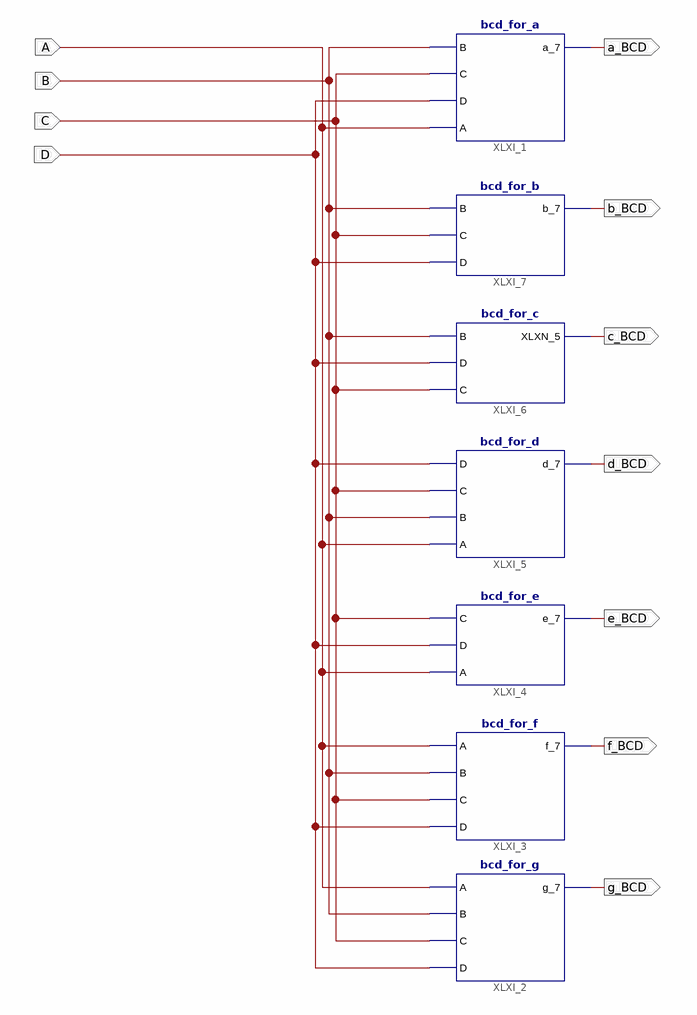
[diagram p0: schematic sheet 1]
// Xilinx ISE schematic BCD_Decoder.sch (spartan6) as structural Verilog: 7 symbols, 11 ports
module BCD_Decoder (
  input  A,
  input  B,
  input  C,
  input  D,
  output a_BCD,
  output b_BCD,
  output c_BCD,
  output d_BCD,
  output e_BCD,
  output f_BCD,
  output g_BCD
);

  bcd_for_a XLXI_1 (.B(B), .C(C), .D(D), .A(A), .a_7(a_BCD));
  bcd_for_g XLXI_2 (.A(A), .B(B), .C(C), .D(D), .g_7(g_BCD));
  bcd_for_f XLXI_3 (.A(A), .B(B), .C(C), .D(D), .f_7(f_BCD));
  bcd_for_e XLXI_4 (.C(C), .D(D), .A(A), .e_7(e_BCD));
  bcd_for_d XLXI_5 (.D(D), .C(C), .B(B), .A(A), .d_7(d_BCD));
  bcd_for_c XLXI_6 (.B(B), .D(D), .C(C), .XLXN_5(c_BCD));
  bcd_for_b XLXI_7 (.B(B), .C(C), .D(D), .b_7(b_BCD));
endmodule
